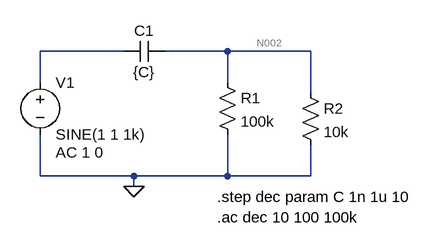
[diagram p0: schematic CL1_T2_HighPassFilter.asc]
CL1_T2_HighPassFilter.asc, the LTspice schematic file:
Version 4.1
SHEET 1 880 680
WIRE 224 80 96 80
WIRE 384 80 288 80
WIRE 512 80 384 80
WIRE 96 128 96 80
WIRE 384 128 384 80
WIRE 512 144 512 80
WIRE 96 272 96 208
WIRE 240 272 96 272
WIRE 384 272 384 208
WIRE 384 272 240 272
WIRE 512 272 512 224
WIRE 512 272 384 272
WIRE 240 288 240 272
FLAG 240 288 0
SYMBOL voltage 96 112 R0
WINDOW 123 24 124 Left 2
WINDOW 39 0 0 Left 0
SYMATTR Value2 AC 1 0
SYMATTR InstName V1
SYMATTR Value SINE(1 1 1k)
SYMBOL res 496 128 R0
SYMATTR InstName R2
SYMATTR Value 10k
SYMBOL cap 288 64 R90
WINDOW 0 0 32 VBottom 2
WINDOW 3 32 32 VTop 2
SYMATTR InstName C1
SYMATTR Value {C}
SYMBOL res 368 112 R0
SYMATTR InstName R1
SYMATTR Value 100k
TEXT 368 304 Left 2 !.step dec param C 1n 1u 10
TEXT 368 336 Left 2 !.ac dec 10 100 100k

The netlist it stands for:
* CL1_T2_HighPassFilter.asc
V1 N001 0 SINE(1 1 1k) AC 1 0
R2 N002 0 10k
C1 N002 N001 {C}
R1 N002 0 100k
.step dec param C 1n 1u 10
.ac dec 10 100 100k
.backanno
.end

* Results of the author's LTspice run, read from the files saved beside the schematic
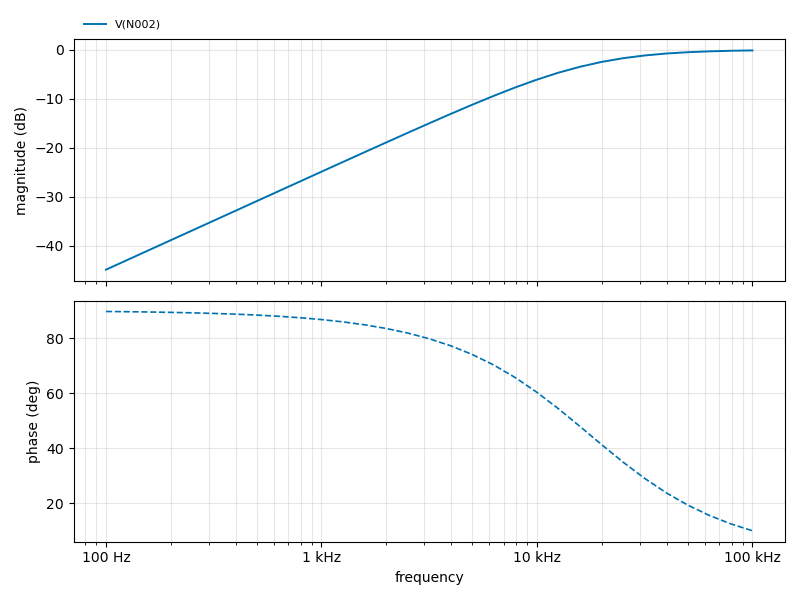
[diagram p1: AC Analysis of CL1_T2_HighPassFilter.asc, plotted from the saved traces]
* AC Analysis, 1 run:
*   V(N002): -44.86 dB at 100 Hz, -0.13 dB at 100 kHz, peak -0.13 dB at 100 kHz, 3 dB below the peak at 17.09 kHz